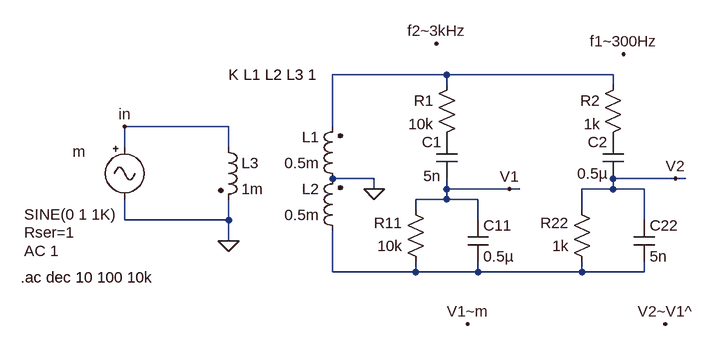
[diagram p0: schematic modulatore_ssb_Hilbert.asc]
modulatore_ssb_Hilbert.asc, the LTspice schematic file:
Version 4
SHEET 1 880 680
WIRE 448 -16 272 -16
WIRE 704 -16 448 -16
WIRE 448 0 448 -16
WIRE 704 0 704 -16
WIRE 112 64 -48 64
WIRE 272 64 272 -16
WIRE -48 96 -48 64
WIRE 112 96 112 64
WIRE 336 144 272 144
WIRE 800 144 704 144
WIRE 816 144 800 144
WIRE 336 160 336 144
WIRE 448 160 448 144
WIRE 544 160 448 160
WIRE 560 160 544 160
WIRE 704 160 704 144
WIRE 704 160 656 160
WIRE 752 160 704 160
WIRE 448 176 448 160
WIRE 448 176 400 176
WIRE 496 176 448 176
WIRE 400 192 400 176
WIRE 656 192 656 160
WIRE -48 208 -48 176
WIRE 112 208 112 176
WIRE 112 208 -48 208
WIRE 496 208 496 176
WIRE 752 208 752 160
WIRE 112 240 112 208
WIRE 272 288 272 224
WIRE 400 288 400 272
WIRE 400 288 272 288
WIRE 496 288 496 272
WIRE 496 288 400 288
WIRE 656 288 656 272
WIRE 656 288 496 288
WIRE 752 288 752 272
WIRE 752 288 656 288
FLAG 336 160 0
FLAG 112 240 0
FLAG 544 160 V1
FLAG 800 144 V2
FLAG -48 64 in
FLAG 720 -48 f1~300Hz
FLAG 432 -64 f2~3kHz
FLAG 480 368 V1~m
FLAG 784 368 V2~V1^
SYMBOL ind2 288 160 R180
WINDOW 0 36 80 Left 2
WINDOW 3 36 40 Left 2
SYMATTR InstName L1
SYMATTR Value 0.5m
SYMATTR Type ind
SYMBOL ind2 288 240 R180
WINDOW 0 36 80 Left 2
WINDOW 3 36 40 Left 2
SYMATTR InstName L2
SYMATTR Value 0.5m
SYMATTR Type ind
SYMBOL ind2 96 80 R0
SYMATTR InstName L3
SYMATTR Value 1m
SYMATTR Type ind
SYMBOL res 464 -16 M0
SYMATTR InstName R1
SYMATTR Value 10k
SYMBOL cap 464 80 M0
WINDOW 3 25 60 Left 2
SYMATTR Value 5n
SYMATTR InstName C1
SYMBOL cap 480 208 R0
SYMATTR InstName C11
SYMATTR Value 0.5µ
SYMBOL res 416 288 R180
WINDOW 0 36 76 Left 2
WINDOW 3 36 40 Left 2
SYMATTR InstName R11
SYMATTR Value 10k
SYMBOL res 720 -16 M0
SYMATTR InstName R2
SYMATTR Value 1k
SYMBOL res 672 288 R180
WINDOW 0 36 76 Left 2
WINDOW 3 36 40 Left 2
SYMATTR InstName R22
SYMATTR Value 1k
SYMBOL cap 720 80 M0
SYMATTR InstName C2
SYMATTR Value 0.5µ
SYMBOL cap 736 208 R0
SYMATTR InstName C22
SYMATTR Value 5n
SYMBOL Misc\\signal -48 80 R0
WINDOW 0 -80 22 Left 2
WINDOW 3 -155 119 Left 2
WINDOW 123 -155 175 Left 2
WINDOW 39 -155 147 Left 2
SYMATTR InstName m
SYMATTR Value2 AC 1
SYMATTR SpiceLine Rser=1
TEXT 112 -16 Left 2 !K L1 L2 L3 1
TEXT -208 296 Left 2 !.ac dec 10 100 10k

The netlist it stands for:
* modulatore_ssb_Hilbert.asc
L1 0 N001 0.5m
L2 N002 0 0.5m
L3 in 0 1m
R1 N001 P001 10k
C1 P001 V1 5n
C11 V1 N002 0.5µ
R11 N002 V1 10k
R2 N001 P002 1k
R22 N002 V2 1k
C2 P002 V2 0.5µ
C22 V2 N002 5n
V§m in 0 SINE(0 1 1K) AC 1 Rser=1
K L1 L2 L3 1
.ac dec 10 100 10k
.backanno
.end